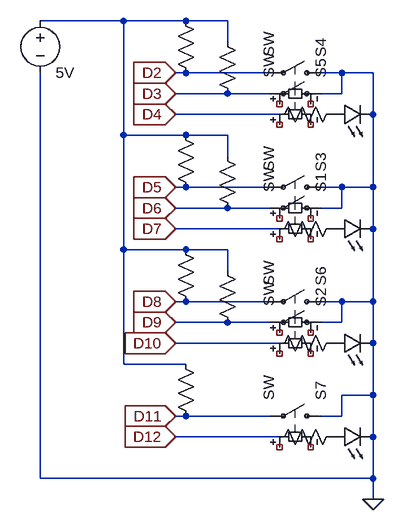
[diagram p0: schematic training.asc]
training.asc, the LTspice schematic file:
Version 4
SHEET 1 1268 868
WIRE 16 16 -112 16
WIRE 112 16 16 16
WIRE 176 16 112 16
WIRE 176 48 176 16
WIRE 112 96 96 96
WIRE 240 96 112 96
WIRE 352 96 320 96
WIRE 400 96 352 96
WIRE 176 128 96 128
WIRE 240 128 176 128
WIRE 352 128 352 96
WIRE 352 128 320 128
WIRE 256 160 96 160
WIRE 400 160 400 96
WIRE 16 192 16 16
WIRE 112 192 16 192
WIRE 176 192 112 192
WIRE 176 224 176 192
WIRE 112 272 96 272
WIRE 240 272 112 272
WIRE 352 272 320 272
WIRE 400 272 400 160
WIRE 400 272 352 272
WIRE 176 304 96 304
WIRE 240 304 176 304
WIRE 352 304 352 272
WIRE 352 304 320 304
WIRE 256 336 96 336
WIRE 400 336 400 272
WIRE 16 368 16 192
WIRE 112 368 16 368
WIRE 176 368 112 368
WIRE 176 400 176 368
WIRE 112 448 96 448
WIRE 240 448 112 448
WIRE 352 448 320 448
WIRE 400 448 400 336
WIRE 400 448 352 448
WIRE 176 480 96 480
WIRE 240 480 176 480
WIRE 352 480 352 448
WIRE 352 480 320 480
WIRE 256 512 96 512
WIRE 400 512 400 448
WIRE 16 544 16 368
WIRE 112 544 16 544
WIRE 400 592 400 512
WIRE 400 592 352 592
WIRE 112 624 96 624
WIRE 240 624 112 624
WIRE 352 624 352 592
WIRE 352 624 320 624
WIRE 256 656 96 656
WIRE 400 656 400 592
WIRE -112 720 -112 96
WIRE 400 720 400 656
WIRE 400 720 -112 720
WIRE 400 752 400 720
FLAG 96 96 D2
IOPIN 96 96 In
FLAG 96 128 D3
IOPIN 96 128 In
FLAG 96 160 D4
IOPIN 96 160 In
FLAG 96 272 D5
IOPIN 96 272 In
FLAG 96 304 D6
IOPIN 96 304 In
FLAG 96 336 D7
IOPIN 96 336 In
FLAG 96 448 D8
IOPIN 96 448 In
FLAG 96 480 D9
IOPIN 96 480 In
FLAG 96 512 D10
IOPIN 96 512 In
FLAG 96 624 D11
IOPIN 96 624 In
FLAG 96 656 D12
IOPIN 96 656 In
FLAG 400 752 0
SYMBOL voltage -112 0 R0
WINDOW 0 24 16 Invisible 2
WINDOW 123 0 0 Left 2
WINDOW 39 0 0 Left 2
SYMATTR InstName V1
SYMATTR Value 5V
SYMBOL res 96 0 R0
WINDOW 0 36 40 Invisible 2
WINDOW 3 36 76 Invisible 2
SYMATTR InstName R1
SYMBOL res 160 32 R0
WINDOW 0 36 40 Invisible 2
WINDOW 3 36 76 Invisible 2
SYMATTR InstName R2
SYMBOL res 96 176 R0
WINDOW 0 36 40 Invisible 2
WINDOW 3 36 76 Invisible 2
SYMATTR InstName R3
SYMBOL res 160 208 R0
WINDOW 0 36 40 Invisible 2
WINDOW 3 36 76 Invisible 2
SYMATTR InstName R4
SYMBOL res 96 528 R0
WINDOW 0 36 40 Invisible 2
WINDOW 3 36 76 Invisible 2
SYMATTR InstName R5
SYMBOL res 96 352 R0
WINDOW 0 36 40 Invisible 2
WINDOW 3 36 76 Invisible 2
SYMATTR InstName R6
SYMBOL res 160 384 R0
WINDOW 0 36 40 Invisible 2
WINDOW 3 36 76 Invisible 2
SYMATTR InstName R7
SYMBOL LED 336 352 R270
WINDOW 0 72 32 Invisible 2
WINDOW 3 0 32 Invisible 2
SYMATTR InstName D1
SYMBOL sw 336 272 M270
SYMATTR InstName S3
SYMBOL sw 336 304 M270
SYMATTR InstName S1
SYMBOL sw 336 480 M270
SYMATTR InstName S2
SYMBOL sw 336 96 M270
SYMATTR InstName S4
SYMBOL sw 336 128 M270
SYMATTR InstName S5
SYMBOL LED 336 176 R270
WINDOW 0 72 32 Invisible 2
WINDOW 3 0 32 Invisible 2
SYMATTR InstName D2
SYMBOL LED 336 528 R270
WINDOW 0 72 32 Invisible 2
WINDOW 3 0 32 Invisible 2
SYMATTR InstName D3
SYMBOL LED 336 672 R270
WINDOW 0 72 32 Invisible 2
WINDOW 3 0 32 Invisible 2
SYMATTR InstName D4
SYMBOL res 352 640 R90
WINDOW 0 0 56 Invisible 2
WINDOW 3 32 56 Invisible 2
SYMATTR InstName R8
SYMBOL res 352 496 R90
WINDOW 0 0 56 Invisible 2
WINDOW 3 32 56 Invisible 2
SYMATTR InstName R9
SYMBOL res 352 320 R90
WINDOW 0 0 56 Invisible 2
WINDOW 3 32 56 Invisible 2
SYMATTR InstName R10
SYMBOL res 352 144 R90
WINDOW 0 0 56 Invisible 2
WINDOW 3 32 56 Invisible 2
SYMATTR InstName R11
SYMBOL sw 336 448 M270
SYMATTR InstName S6
SYMBOL sw 336 624 M270
SYMATTR InstName S7

The netlist it stands for:
* training.asc
V1 N001 0 5V
R1 N001 D2 R
R2 N001 D3 R
R3 N001 D5 R
R4 N001 D6 R
R5 N001 D11 R
R6 N001 D8 R
R7 N001 D9 R
D1 P001 0 D
S3 0 D5 NC_01 NC_02 SW
S1 0 D6 NC_03 NC_04 SW
S2 0 D9 NC_05 NC_06 SW
S4 0 D2 NC_07 NC_08 SW
S5 0 D3 NC_09 NC_10 SW
D2 P002 0 D
D3 P003 0 D
D4 P004 0 D
R8 P004 D12 R
R9 P003 D10 R
R10 P001 D7 R
R11 P002 D4 R
S6 0 D8 NC_11 NC_12 SW
S7 0 D11 NC_13 NC_14 SW
.model D D
.lib standard.dio
.backanno
.end